# EAGLE design CCM_0025 (EAGLE 9.5.1)

## Sheet 1 of 2: PID
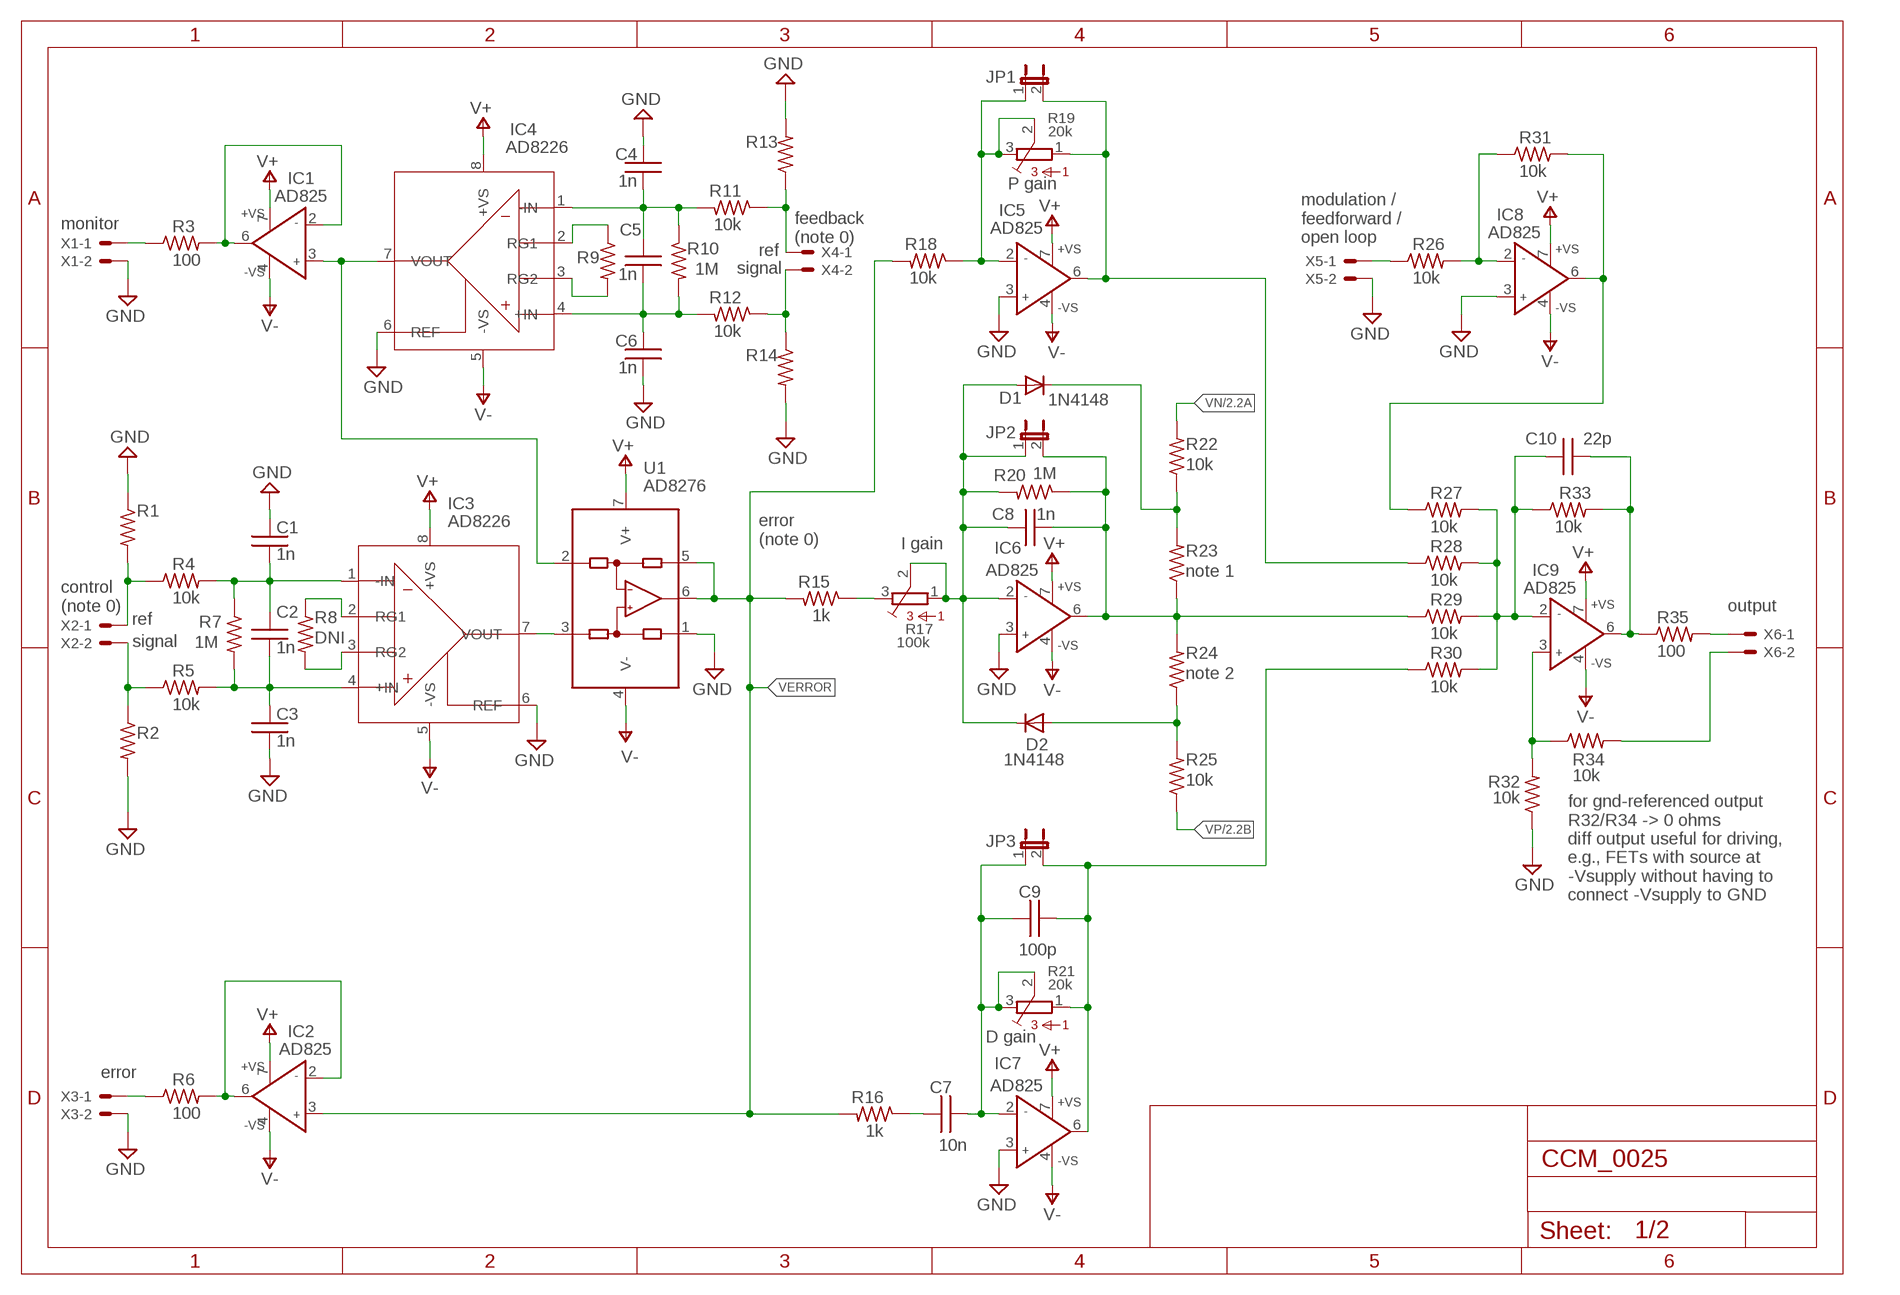
[diagram p0: schematic, sheet 1]

### Parts
C1  1n  C0603  [0603]
C2  1n  C0603  [0603]
C3  1n  C0603  [0603]
C4  1n  C0603  [0603]
C5  1n  C0603  [0603]
C6  1n  C0603  [0603]
C7  10n  C0603  [0603]
C8  1n  C0603  [0603]
C9  100p  C0603  [0603]
C10  22p  C0603  [0603]
D1  1N4148  [SOD323_ST]
D2  1N4148  [SOD323_ST]
IC1  AD825  AD825_BR  [SO8]
IC2  AD825  AD825_BR  [SO8]
IC3  AD8226  [SO08]
IC4  AD8226  [SO08]
IC5  AD825  AD825_BR  [SO8]
IC6  AD825  AD825_BR  [SO8]
IC7  AD825  AD825_BR  [SO8]
IC8  AD825  AD825_BR  [SO8]
IC9  AD825  AD825_BR  [SO8]
JP1  JP1E  [JP1]
JP2  JP1E  [JP1]
JP3  JP1E  [JP1]
R1  10k  R0603  [0603]
R2  10k  R0603  [0603]
R3  100  R0603  [0603]
R4  10k  R0603  [0603]
R5  10k  R0603  [0603]
R6  100  R0603  [0603]
R7  1M  R0603  [0603]
R8  DNI  R0603  [0603]
R9  DNI  R0603  [0603]
R10  1M  R0603  [0603]
R11  10k  R0603  [0603]
R12  10k  R0603  [0603]
R13  10k  R0603  [0603]
R14  10k  R0603  [0603]
R15  1k  R0603  [0603]
R16  1k  R0603  [0603]
R17  100k  3386-C  [3386C]
R18  10k  R0603  [0603]
R19  20k  3386-C  [3386C]
R20  1M  R0603  [0603]
R21  20k  3386-C  [3386C]
R22  10k  R0603  [0603]
R23  note 1  R0603  [0603]
R24  note 2  R0603  [0603]
R25  10k  R0603  [0603]
R26  10k  R0603  [0603]
R27  10k  R0603  [0603]
R28  10k  R0603  [0603]
R29  10k  R0603  [0603]
R30  10k  R0603  [0603]
R31  10k  R0603  [0603]
R32  10k  R0603  [0603]
R33  10k  R0603  [0603]
R34  10k  R0603  [0603]
R35  100  R0603  [0603]
U1  AD8276  [SO8]
X1  22-23-2021  [22-23-2021]
X2  22-23-2021  [22-23-2021]
X3  22-23-2021  [22-23-2021]
X4  22-23-2021  [22-23-2021]
X5  22-23-2021  [22-23-2021]
X6  22-23-2021  [22-23-2021]

### Nets
GND: C1.1 C3.2 C4.1 C6.2 IC3.6(REF) IC4.6(REF) IC5.3(IN+) IC6.3(IN+) IC7.3(IN+) IC8.3(IN+) R1.1 R2.2 R13.2 R14.2 R32.1 U1.1(REF) X1.2 X3.2 X5.2 ; also sheet 2
N$1: R2.1 R5.1 X2.2
N$2: R1.2 R4.1 X2.1
N$3: C7.1 C9.2 IC7.2(IN-) JP3.1 R21.2 R21.3
N$4: IC3.2(RG1) R8.1
N$5: C1.2 C2.1 IC3.1(-IN) R4.2 R7.1
N$6: C2.2 C3.1 IC3.4(+IN) R5.2 R7.2
N$7: R3.1 X1.1
N$8: IC3.3(RG2) R8.2
N$9: IC1.2(IN-) IC1.6(OUT) R3.2
N$10: R26.1 X5.1
N$11: C9.1 IC7.6(OUT) JP3.2 R21.1 R30.1
N$12: C7.2 R16.1
N$13: R34.2 X6.2
N$14: C10.2 IC9.2(IN-) R27.2 R28.2 R29.2 R30.2 R33.1
N$15: D1.C R22.1 R23.2
N$16: C10.1 IC9.6(OUT) R33.2 R35.1
N$17: IC9.3(IN+) R32.2 R34.1
N$19: R35.2 X6.1
N$20: IC3.7(VOUT) U1.3(+IN)
N$21: R12.1 R14.1 X4.2
N$23: IC4.2(RG1) R9.1
N$24: IC4.3(RG2) R9.2
N$25: C4.2 C5.1 IC4.1(-IN) R10.1 R11.2
N$26: C5.2 C6.1 IC4.4(+IN) R10.2 R12.2
N$27: R11.1 R13.1 X4.1
N$30: IC5.2(IN-) JP1.1 R18.1 R19.2 R19.3
N$31: IC5.6(OUT) JP1.2 R19.1 R28.1
N$32: R15.1 R17.3
N$33: C8.2 D1.A D2.C IC6.2(IN-) JP2.1 R17.1 R17.2 R20.2
N$34: D2.A R24.1 R25.2
N$36: C8.1 IC6.6(OUT) JP2.2 R20.1 R23.1 R24.2 R29.1
N$37: IC1.3(IN+) IC4.7(VOUT) U1.2(-IN)
N$38: R6.1 X3.1
N$39: IC2.2(IN-) IC2.6(OUT) R6.2
N$46: IC8.2(IN-) R26.2 R31.1
N$47: IC8.6(OUT) R27.1 R31.2
V+: IC1.7(+VS) IC2.7(+VS) IC3.8(+VS) IC4.8(+VS) IC5.7(+VS) IC6.7(+VS) IC7.7(+VS) IC8.7(+VS) IC9.7(+VS) U1.7(V+) ; also sheet 2
V-: IC1.4(-VS) IC2.4(-VS) IC3.5(-VS) IC4.5(-VS) IC5.4(-VS) IC6.4(-VS) IC7.4(-VS) IC8.4(-VS) IC9.4(-VS) U1.4(V-) ; also sheet 2
VERROR: IC2.3(IN+) R15.2 R16.2 R18.2 U1.5(SENSE) U1.6(OUT)
VN: R22.2 ; also sheet 2
VP: R25.1 ; also sheet 2

### Notes on the sheet
- P gain
- monitor
- feedback
  (note 0)
- modulation /
  feedforward /
  open loop
- ref
- signal
- error
  (note 0)
- I gain
- control
  (note 0)
- output
- ref
- signal
- for gnd-referenced output
  R32/R34 -> 0 ohms
  diff output useful for driving, 
  e.g., FETs with source at 
  -Vsupply without having to 
  connect -Vsupply to GND
- D gain
- error

## Sheet 2 of 2: misc
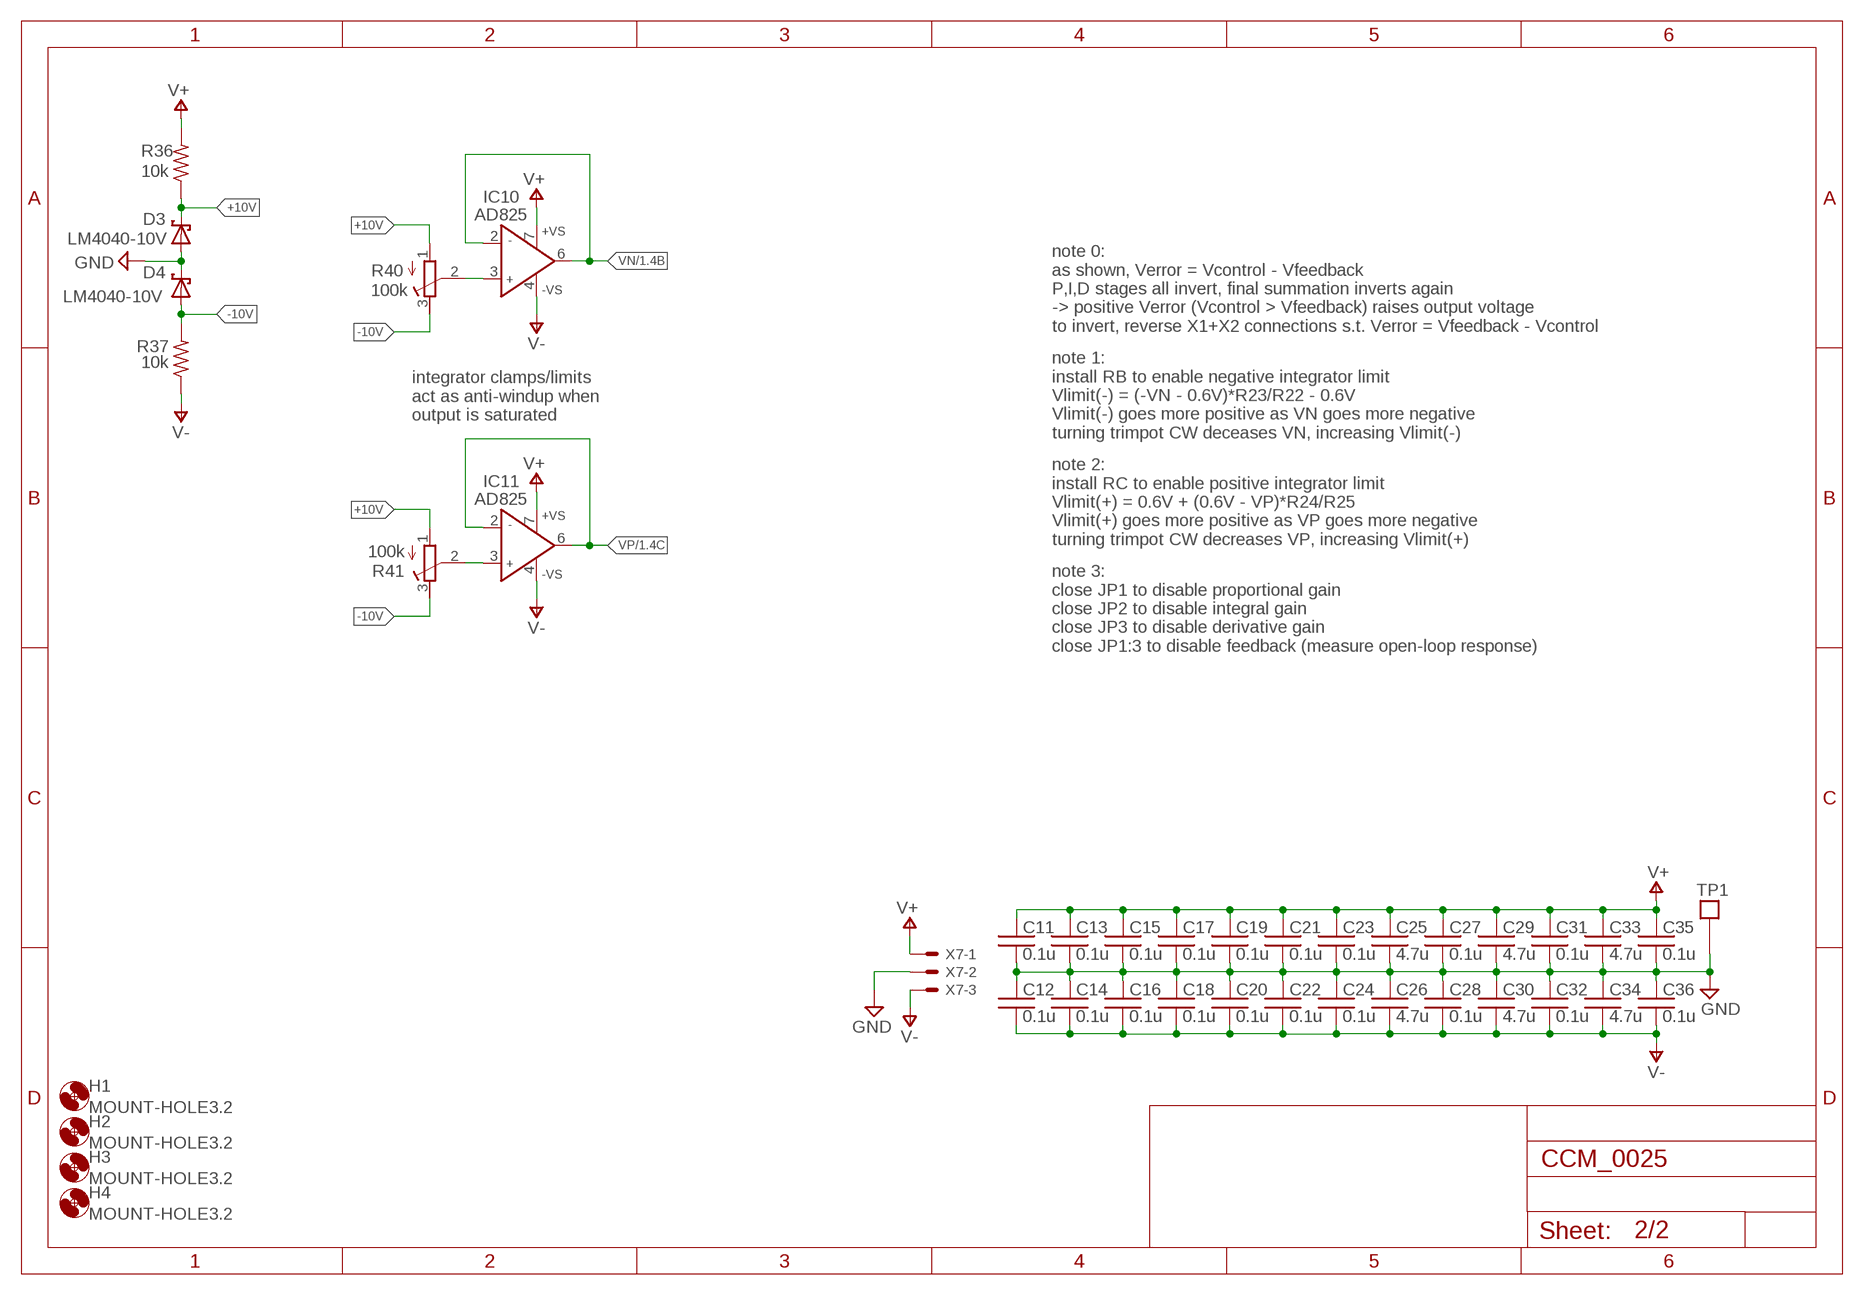
[diagram p1: schematic, sheet 2]

### Parts
C11  0.1u  C0603  [0603]
C12  0.1u  C0603  [0603]
C13  0.1u  C0603  [0603]
C14  0.1u  C0603  [0603]
C15  0.1u  C0603  [0603]
C16  0.1u  C0603  [0603]
C17  0.1u  C0603  [0603]
C18  0.1u  C0603  [0603]
C19  0.1u  C0603  [0603]
C20  0.1u  C0603  [0603]
C21  0.1u  C0603  [0603]
C22  0.1u  C0603  [0603]
C23  0.1u  C0603  [0603]
C24  0.1u  C0603  [0603]
C25  4.7u  C0603  [0603]
C26  4.7u  C0603  [0603]
C27  0.1u  C0603  [0603]
C28  0.1u  C0603  [0603]
C29  4.7u  C0603  [0603]
C30  4.7u  C0603  [0603]
C31  0.1u  C0603  [0603]
C32  0.1u  C0603  [0603]
C33  4.7u  C0603  [0603]
C34  4.7u  C0603  [0603]
C35  0.1u  C0603  [0603]
C36  0.1u  C0603  [0603]
D3  LM4040-10V  LM4040  [SOT23]
D4  LM4040-10V  LM4040  [SOT23]
H1  MOUNT-HOLE3.2  [3,2]
H2  MOUNT-HOLE3.2  [3,2]
H3  MOUNT-HOLE3.2  [3,2]
H4  MOUNT-HOLE3.2  [3,2]
IC10  AD825  AD825_BR  [SO8]
IC11  AD825  AD825_BR  [SO8]
R36  10k  R0603  [0603]
R37  10k  R0603  [0603]
R40  100k  R-TRIMM3296W  [RTRIM3296W]
R41  100k  R-TRIMM3296W  [RTRIM3296W]
TP1  TESTPOINT  [TESTPOINT]
X7  22-23-2031  [22-23-2031]

### Nets
+10V: D3.1(C) R36.1 R40.1(A) R41.1(A)
-10V: D4.2(A) R37.2 R40.3(E) R41.3(E)
GND: C11.2 C12.1 C13.2 C14.1 C15.2 C16.1 C17.2 C18.1 C19.2 C20.1 C21.2 C22.1 C23.2 C24.1 C25.2 C26.1 C27.2 C28.1 C29.2 C30.1 C31.2 C32.1 C33.2 C34.1 C35.2 C36.1 D3.2(A) D4.1(C) TP1.P$1 X7.2 ; also sheet 1
N$41: IC10.3(IN+) R40.2(S)
N$44: IC11.3(IN+) R41.2(S)
V+: C11.1 C13.1 C15.1 C17.1 C19.1 C21.1 C23.1 C25.1 C27.1 C29.1 C31.1 C33.1 C35.1 IC10.7(+VS) IC11.7(+VS) R36.2 X7.1 ; also sheet 1
V-: C12.2 C14.2 C16.2 C18.2 C20.2 C22.2 C24.2 C26.2 C28.2 C30.2 C32.2 C34.2 C36.2 IC10.4(-VS) IC11.4(-VS) R37.1 X7.3 ; also sheet 1
VN: IC10.2(IN-) IC10.6(OUT) ; also sheet 1
VP: IC11.2(IN-) IC11.6(OUT) ; also sheet 1

### Notes on the sheet
- note 0:
  as shown, Verror = Vcontrol - Vfeedback
  P,I,D stages all invert, final summation inverts again
  -> positive Verror (Vcontrol > Vfeedback) raises output voltage
  to invert, reverse X1+X2 connections s.t. Verror = Vfeedback - Vcontrol
- integrator clamps/limits
  act as anti-windup when
  output is saturated
- note 1:
  install RB to enable negative integrator limit
  Vlimit(-) = (-VN - 0.6V)*R23/R22 - 0.6V
  Vlimit(-) goes more positive as VN goes more negative
  turning trimpot CW deceases VN, increasing Vlimit(-)
- note 2:
  install RC to enable positive integrator limit
  Vlimit(+) = 0.6V + (0.6V - VP)*R24/R25
  Vlimit(+) goes more positive as VP goes more negative
  turning trimpot CW decreases VP, increasing Vlimit(+)
- note 3:
  close JP1 to disable proportional gain
  close JP2 to disable integral gain
  close JP3 to disable derivative gain
  close JP1:3 to disable feedback (measure open-loop response)

## Library data of the parts
C1-C36 = acrooptics:C: Capacitor
D1 D2 = custom_parts:1N4148: DIODE high speed (Philips)
D3 D4 = noah:LM4040: LM4040 Reference Zener Diode
H1-H4 = holes:MOUNT-HOLE: MOUNTING HOLE with drill center marker
IC1 IC2 IC5-IC11 = noah:AD825_B: Low Cost, General-Purpose High Speed JFET Amplifier Source: http://www.analog.com/static/imported-files/data_sheets/AD825.pdf; MF: ALTERA CORPORATION; MPN: AD825ARZ; OC_FARNELL: 9603735; OC_NEWARK: 59K6528
IC3 IC4 = noah:AD8226
JP1-JP3 = jumper:JP1E: JUMPER
R1-R16 R18 R20 R22-R37 = acrooptics:R: 0603 resistor
R17 R19 R21 = bourns:3386-: 3386 Series 3/8" Square Trimmer
R40 R41 = rcl:R-TRIMM: Trimm resistor; SPICEMODEL: X; SPICEPREFIXL: POT
TP1 = Fitch:TESTPOINT
U1 = noah:AD8276: Precision Unity Gain Diff. Amplifier
X1-X6 = con-molex:22-23-2021: .100" (2.54mm) Center Header - 2 Pin; MF: MOLEX; MPN: 22-23-2021; OC_FARNELL: 1462926; OC_NEWARK: 25C3832
X7 = con-molex:22-23-2031: .100" (2.54mm) Center Header - 3 Pin; MF: MOLEX; MPN: 22-23-2031; OC_FARNELL: 1462950; OC_NEWARK: 30C0862

## Net classes
1 standard: width 0.61 mm, clearance 0.254 mm

## Board
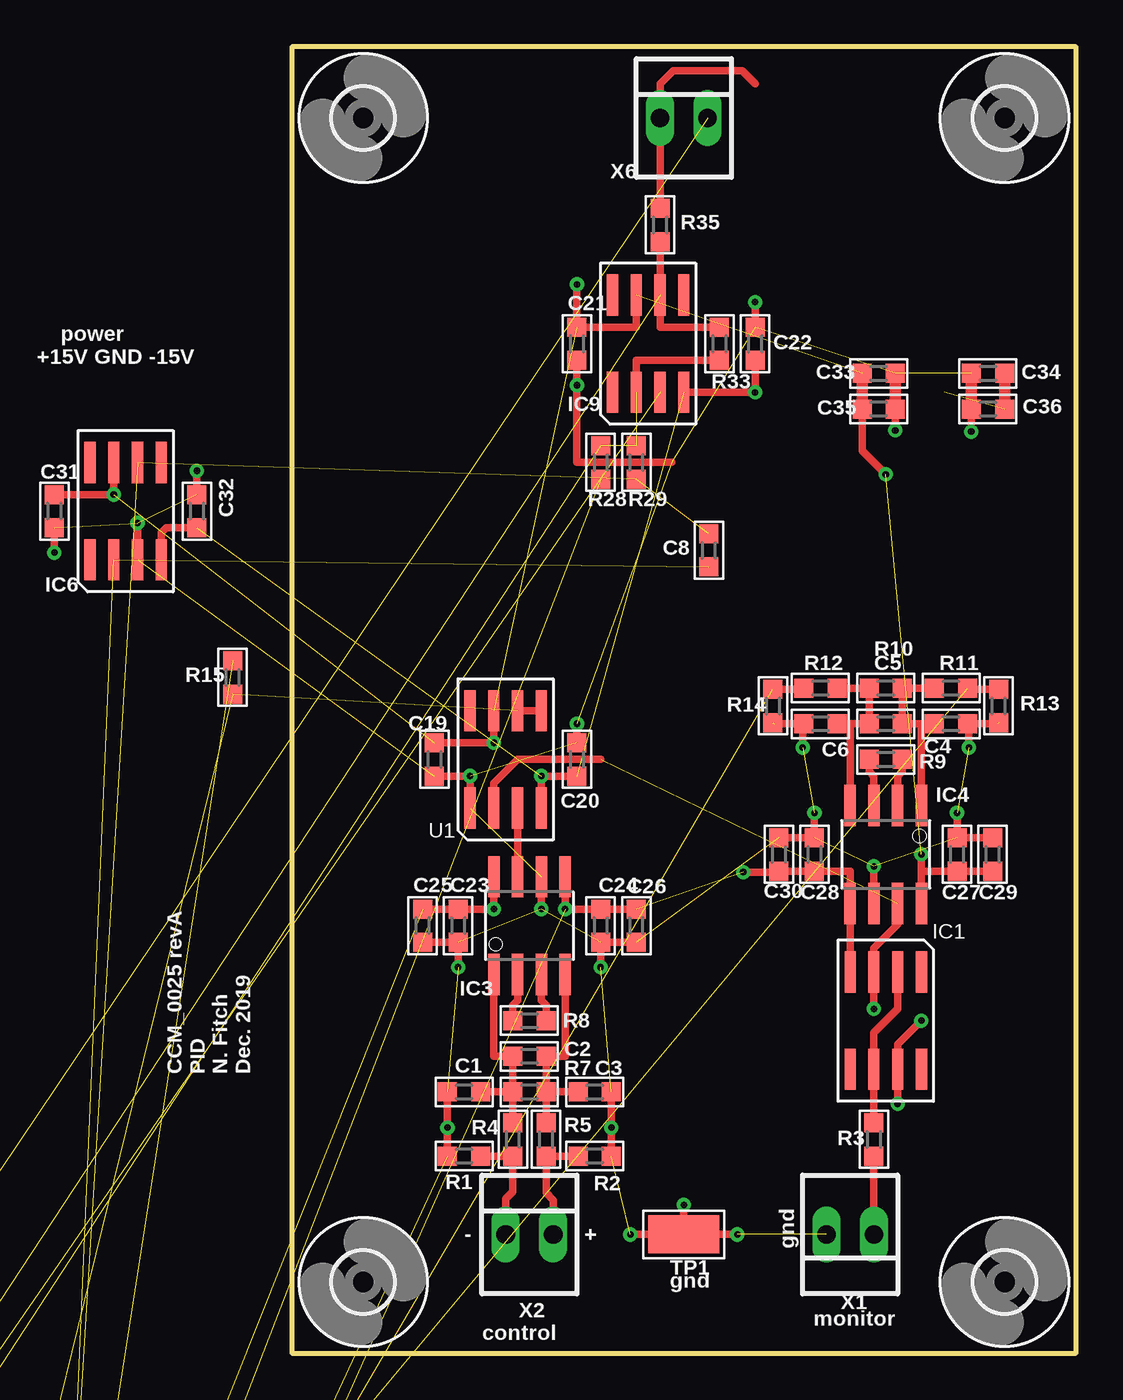
[diagram p2: board, top side]
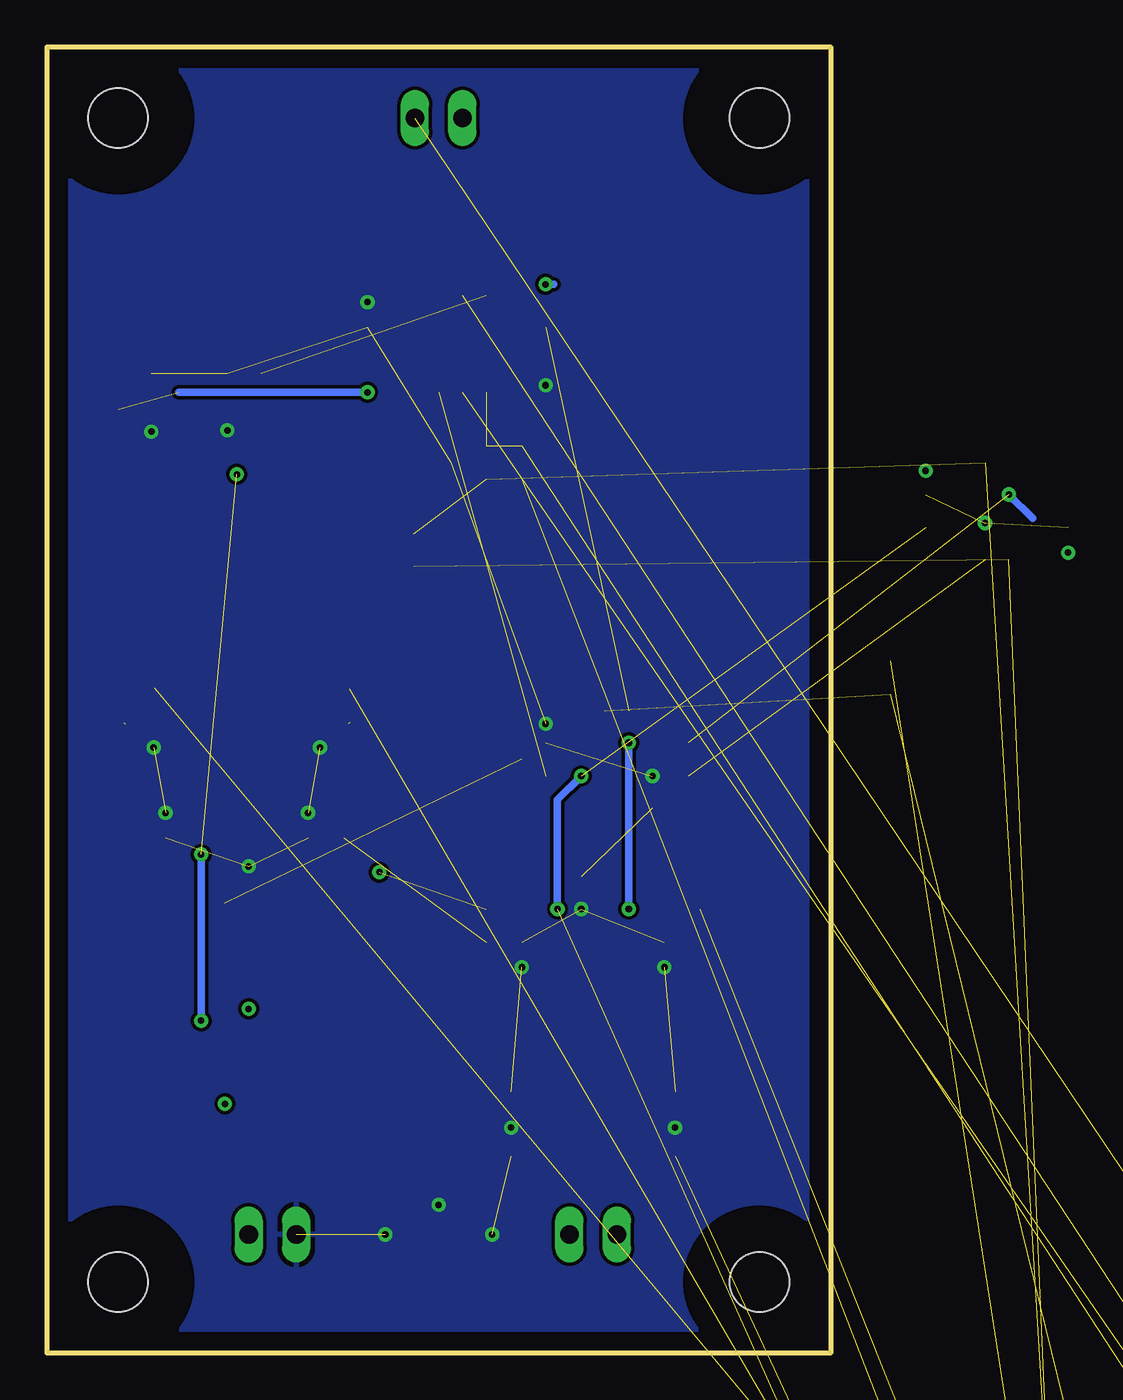
[diagram p3: board, bottom side, seen from below]

Size 41.91 x 69.85 mm. Coordinates in mm from the lower left corner, seen from the top.
Outline: 0,0 41.91,0 41.91,69.85 0,69.85 0,0
Copper layers (1*16): Top 0.035mm / dielectric 1.5mm / Bottom 0.035mm
Design rules "default *": minimum track width 10mil, minimum drill 10mil, track to track 7mil, track to pad 7mil, pad to pad 7mil, via to via 7mil, smd to smd 7mil, copper to edge 10mil, drill to drill 8mil, minimum pad ring 10mil, minimum via ring 8mil, stop-mask expansion 4mil, vias tented up to drill 0mil, thermal gap 10mil

### Footprints (pad centres in the part's own frame; a part is rotated, then mirrored left to right if it is on the bottom)
0603 = smd 1.016 x 1.016: 1 -0.889,0; 2 0.889,0
SOD323_ST = smd 0.8 x 0.6: A 1.25,0; C -1.25,0
SOT23 = smd 1 x 1.4: 1 -0.95,-1.1; 2 0.95,-1.1; 3 0,1.1
3,2 = hole 3.2: 0,0
SO8 = smd 0.6 x 2.2: 1 -1.905,-2.6; 2 -0.635,-2.6; 3 0.635,-2.6; 4 1.905,-2.6; 5 1.905,2.6; 6 0.635,2.6; 7 -0.635,2.6; 8 -1.905,2.6
SO08 = smd 0.61 x 2.21: 1 -1.905,-2.616; 2 -0.635,-2.616; 3 0.635,-2.616; 4 1.905,-2.616; 5 1.905,2.616; 6 0.635,2.616; 7 -0.635,2.616; 8 -1.905,2.616
JP1 = drill 0.914 long: 1 0,-1.27; 2 0,1.27
3386C = drill 0.813 pad 1.676 octagon: 1 2.54,1.27; 2 0,1.27; 3 -2.54,1.27
RTRIM3296W = drill 0.61: 1 0,-2.54; 2 0,0; 3 0,2.54
TESTPOINT = smd 3.81 x 2.032: P$1 0,0
22-23-2021 = drill 1 long: 1 -1.27,0; 2 1.27,0
22-23-2031 = drill 1 long: 1 -2.54,0; 2 0,0; 3 2.54,0

### Placement (x,y rotation side)
C1  9.21,13.97 0 top
C2  12.7,15.88 0 top
C3  16.19,13.97 0 top
C4  35.24,33.66 180 top
C5  31.75,33.66 180 top
C6  28.26,33.66 180 top
C7  -34.67,-65.09 0 top  (outside the outline)
C8  22.29,42.93 270 top
C9  -38.93,-65.09 0 top  (outside the outline)
C10  -97.98,-124.02 0 top  (outside the outline)
C11  -134.43,-226.95 0 top  (outside the outline)
C12  -138.68,-226.95 0 top  (outside the outline)
C13  -93.73,-124.02 0 top  (outside the outline)
C14  -89.85,-124.02 0 top  (outside the outline)
C15  -93.73,-119.63 0 top  (outside the outline)
C16  -89.85,-119.63 0 top  (outside the outline)
C17  -93.73,-115.25 0 top  (outside the outline)
C18  -89.85,-115.25 0 top  (outside the outline)
C19  7.62,31.75 270 top
C20  15.24,31.75 270 top
C21  15.24,53.98 270 top
C22  24.77,53.98 270 top
C23  8.89,22.86 270 top
C24  16.51,22.86 90 top
C25  6.99,22.86 270 top
C26  18.41,22.86 90 top
C27  35.56,26.67 90 top
C28  27.94,26.67 270 top
C29  37.47,26.67 90 top
C30  26.04,26.67 270 top
C31  -12.7,45.02 270 top  (outside the outline)
C32  -5.08,45.02 270 top  (outside the outline)
C33  31.37,52.39 0 top
C34  37.21,52.39 0 top
C35  31.37,50.48 0 top
C36  37.21,50.48 0 top
D1  -121.79,-178.31 0 top  (outside the outline)
D2  -121.79,-183.45 0 top  (outside the outline)
D3  -112.59,-139.89 0 top  (outside the outline)
D4  -112.59,-147.32 0 top  (outside the outline)
H1  3.81,3.81 0 top
H2  3.81,66.04 0 top
H3  38.1,3.81 0 top
H4  38.1,66.04 0 top
IC1  31.75,17.78 180 top
IC2  -74.23,-97.85 0 top  (outside the outline)
IC3  12.7,22.86 0 top
IC4  31.75,26.67 180 top
IC5  -14.92,-35.5 0 top  (outside the outline)
IC6  -8.89,45.02 0 top  (outside the outline)
IC7  -27.69,-62.99 0 top  (outside the outline)
IC8  -118.94,-224.85 0 top  (outside the outline)
IC9  19.05,53.98 0 top
IC10  -109.98,-156.46 0 top  (outside the outline)
IC11  -109.98,-199.14 0 top  (outside the outline)
JP1  -112.2,-123.25 0 top  (outside the outline)
JP2  -12.19,-18.67 0 top  (outside the outline)
JP3  -44.64,-64.33 0 top  (outside the outline)
R1  9.21,10.54 0 top
R2  16.19,10.54 0 top
R3  31.11,11.43 90 top
R4  11.81,11.43 90 top
R5  13.59,11.43 90 top
R6  -66.99,-95.5 0 top  (outside the outline)
R7  12.7,13.97 0 top
R8  12.7,17.78 0 top
R9  31.75,31.75 180 top
R10  31.75,35.56 180 top
R11  35.24,35.56 180 top
R12  28.26,35.56 0 top
R13  37.78,34.61 270 top
R14  25.72,34.61 270 top
R15  -3.17,36.13 270 top  (outside the outline)
R16  -20.45,-60.64 0 top  (outside the outline)
R17  -10.35,-26.73 0 top  (outside the outline)
R18  -21.91,-37.59 0 top  (outside the outline)
R19  -18.92,-44.89 0 top  (outside the outline)
R20  -17.65,-28.77 0 top  (outside the outline)
R21  -27.43,-54.23 0 top  (outside the outline)
R22  -121.67,-188.02 0 top  (outside the outline)
R23  -121.67,-192.41 0 top  (outside the outline)
R24  -68.01,-69.47 0 top  (outside the outline)
R25  -68.01,-73.85 0 top  (outside the outline)
R26  -125.92,-226.95 0 top  (outside the outline)
R27  -81.22,-99.95 0 top  (outside the outline)
R28  16.51,47.62 90 top
R29  18.41,47.62 90 top
R30  -85.47,-99.95 0 top  (outside the outline)
R31  -130.18,-226.95 0 top  (outside the outline)
R32  -102.23,-124.02 0 top  (outside the outline)
R33  22.86,53.98 90 top
R34  -106.49,-124.02 0 top  (outside the outline)
R35  19.68,60.33 90 top
R36  -26.16,-46.93 0 top  (outside the outline)
R37  -30.42,-46.93 0 top  (outside the outline)
R40  -119.51,-155.83 0 top  (outside the outline)
R41  -119.51,-199.52 0 top  (outside the outline)
TP1  20.95,6.35 0 top
U1  11.43,31.75 0 top
X1  29.84,6.35 180 top
X2  12.7,6.35 0 top
X3  -76.14,-87.82 0 top  (outside the outline)
X4  -5.71,-16.13 0 top  (outside the outline)
X5  -84.71,-107.57 0 top  (outside the outline)
X6  20.95,66.04 0 top
X7  -91.69,-107.57 0 top  (outside the outline)

### Tracks (layer width: path | path; a pad name or v marks a point on that pad's centre or on a via)
+10V  (3 unrouted)
-10V  (3 unrouted)
GND  (via drill 0.35)  (39 unrouted)
  Top 0.406: IC3.6 v13.34,23.75 | 25.78,33.66 C6.2 27.3,33.59 v27.3,32.38 | 37.72,33.66 C4.1 36.2,33.59 v36.2,32.38 | IC4.6 v31.11,26.04 | IC6.3 v-8.26,44.39 | C1.1 R1.1 v8.32,12.06 | C3.2 R2.2 v17.08,12.06 | U1.1 v9.53,30.86 C19.2 | v16.51,20.64 C24.1 C26.1 | v8.89,20.64 C23.2 C25.2 | C21.2 v15.24,51.75 15.24,47.62 20.32,47.62 | C22.1 v24.77,56.2 | v27.94,28.89 C28.1 C30.1 | v35.56,28.89 C27.2 C29.2 | TP1.P$1 v18.1,6.35 | TP1.P$1 v20.95,7.94 | TP1.P$1 v23.81,6.35 | C31.2 v-12.7,42.8 | C32.1 v-5.08,47.18 | C36.1 v36.32,49.28 | C35.2 v32.26,49.34 | C20.1 v15.24,33.66
  Top 0.61: C33.2 C35.2 | C36.1 C34.1
  pour Bottom: 1.27,1.27 1.27,68.58 40.64,68.58 40.64,1.27
N$1
  Top 0.406: X2.2 13.97,8.19 13.59,8.57 R5.1 R2.1
N$2
  Top 0.406: X2.1 11.43,8.26 11.81,8.64 R4.1 R1.2
N$3  (5 unrouted)
N$4
  Top 0.406: IC3.2 12.06,18.86 11.81,18.61 R8.1
N$5
  Top 0.406: IC3.1 10.79,15.88 C2.1 R7.1 | R7.1 R4.2 | R7.1 C1.2
N$6
  Top 0.406: IC3.4 14.61,15.88 C2.2 R7.2 | R7.2 R5.2 | C3.1 R7.2
N$7
  Top 0.406: R3.1 X1.1
N$8
  Top 0.406: IC3.3 13.34,18.86 13.59,18.61 R8.2
N$9
  Top 0.406: R3.2 IC1.6 31.11,17.14 32.38,18.41 IC1.2
N$10  (1 unrouted)
N$11  (4 unrouted)
N$12  (1 unrouted)
N$13  (1 unrouted)
N$14  (5 unrouted)
  Top 0.406: R33.1 18.41,53.09 IC9.2
N$15  (2 unrouted)
N$16  (1 unrouted)
  Top 0.406: R33.2 19.68,54.86 IC9.6 R35.1
N$17  (2 unrouted)
N$19
  Top 0.406: R35.2 X6.1 19.68,67.88 20.38,68.58 24.07,68.58 24.77,67.88
N$20
  Top 0.406: U1.3 IC3.7
N$21  (1 unrouted)
  Top 0.406: R14.1 27.3,35.5 R12.1
N$23
  Top 0.406: IC4.2 32.38,30.86 32.64,31.11 R9.1
N$24
  Top 0.406: IC4.3 31.11,30.86 30.86,31.11 R9.2
N$25
  Top 0.406: 33.66,33.66 C5.1 R10.1 R11.2 | 33.66,33.66 C4.2 | IC4.1 33.66,33.66
N$26
  Top 0.406: 29.84,33.66 C5.2 R10.2 R12.2 | 29.84,33.66 C6.1 | IC4.4 29.84,33.66
N$27  (1 unrouted)
  Top 0.406: R13.1 36.2,35.5 R11.1
N$30  (4 unrouted)
N$31  (3 unrouted)
N$32  (1 unrouted)
N$33  (7 unrouted)
N$34  (2 unrouted)
N$36  (6 unrouted)
N$37  (via drill 0.35)  (1 unrouted)
  Top 0.406: v31.11,18.41 IC1.3 31.11,21.65 32.38,22.92 IC4.7 | U1.2 10.79,30.48 12.06,31.75 16.51,31.75
N$38  (1 unrouted)
N$39  (2 unrouted)
N$41  (1 unrouted)
N$44  (1 unrouted)
N$46  (2 unrouted)
N$47  (2 unrouted)
V+  (via drill 0.35)  (16 unrouted)
  Top 0.406: IC3.8 v10.79,23.75 C23.1 C25.1 | IC9.7 18.41,54.86 C21.1 v15.24,57.15 | C29.1 C27.1 33.66,25.78 | 33.66,24.77 IC4.8 33.66,25.78 | v32.38,13.34 IC1.7 32.38,16.51 v33.66,17.78 | C35.1 30.48,48.26 v31.75,46.99 | v33.66,26.67 33.66,25.78 | IC6.7 v-9.53,45.91 C31.1 | U1.7 v10.79,32.64 C19.1
  Top 0.61: C33.1 C35.1
  Bottom 0.406: v15.24,57.15 14.8,57.15 | v33.66,17.78 v33.66,26.67 | v-9.53,45.91 -10.79,44.64 | v10.79,32.64 v10.79,23.75
V-  (via drill 0.35)  (16 unrouted)
  Top 0.406: C22.2 v24.77,51.38 IC9.4 | C26.2 C24.2 v14.61,23.75 IC3.5 | v24.13,25.72 25.97,25.72 C30.2 C28.2 29.84,25.78 IC4.5 IC1.4 | C32.2 -6.73,44.13 -6.99,43.88 IC6.4 | U1.4 v13.34,30.86 C20.2
  Top 0.61: C34.2 C36.2
  Bottom 0.406: 34.87,51.38 v24.77,51.38 | v13.34,30.86 14.61,29.59 v14.61,23.75
VERROR  (4 unrouted)
  Top 0.406: U1.6 U1.5
VN  (2 unrouted)
VP  (2 unrouted)

### Text on the board
tPlace: CCM_0025 revA / PID / N. Fitch / Dec. 2019 | gnd
tNames: power / +15V GND -15V | - | + | gnd | control | monitor